# EAGLE design charger_booster_reva (EAGLE 7.2.0)
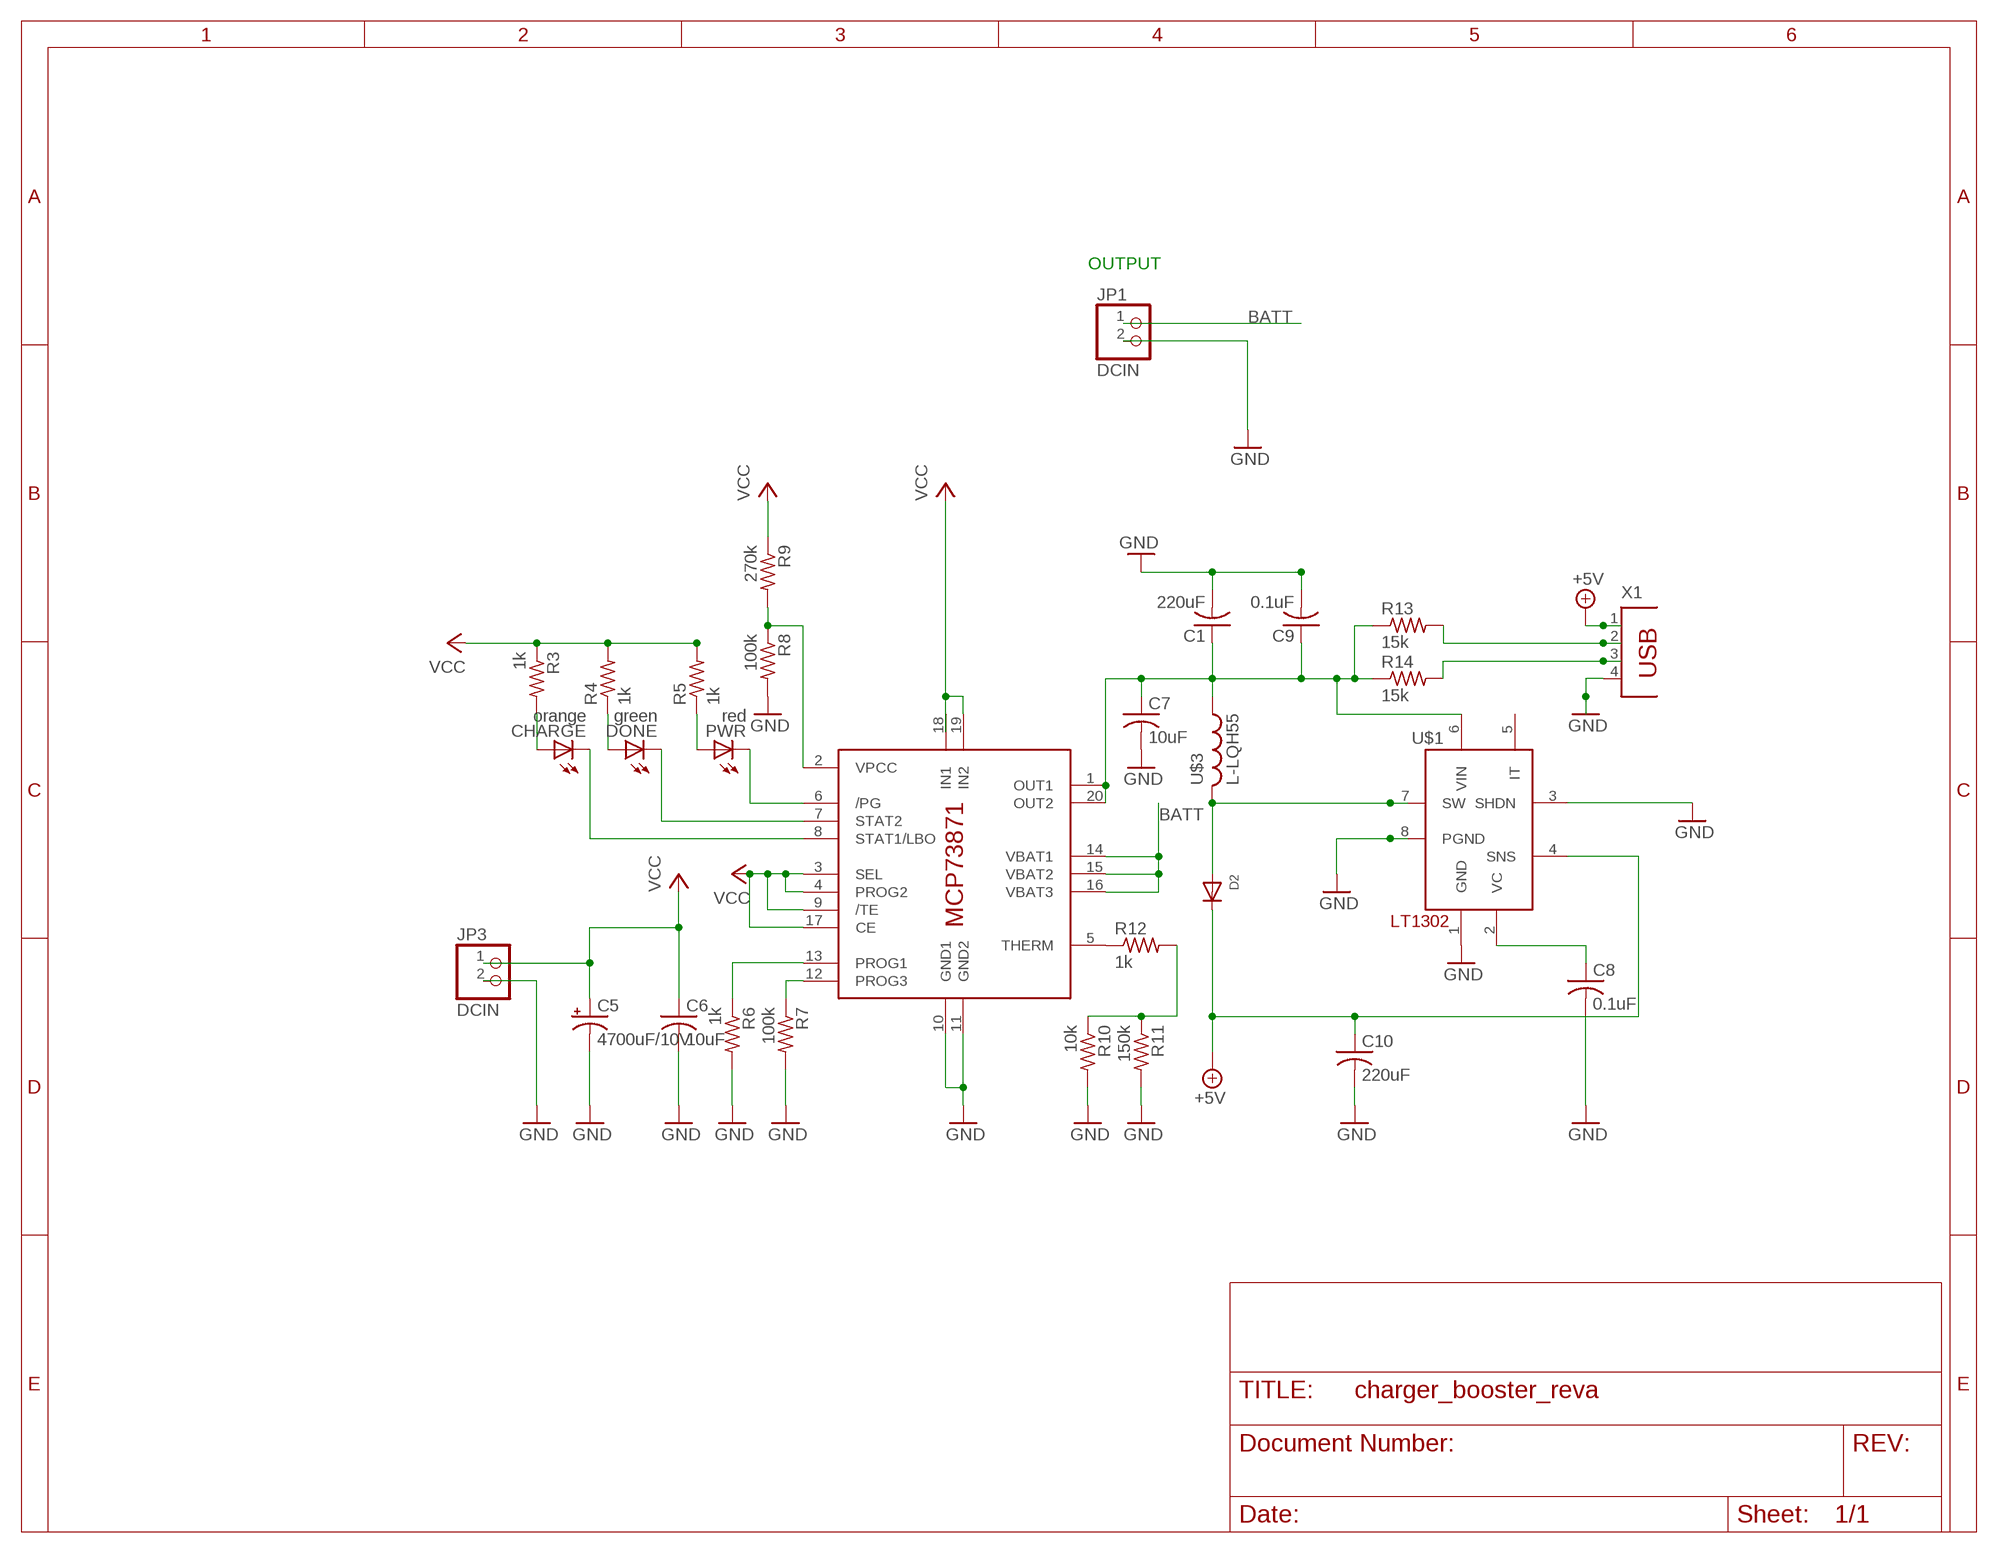
[diagram p0: schematic, sheet 1]

## Parts
C1  220uF  C-USC0805K  [C0805K]
C5  4700uF/10V  CPOL-USE5-13  [E5-13]
C6  10uF  C-USC0805K  [C0805K]
C7  10uF  C-USC0805K  [C0805K]
C8  0.1uF  C-USC0805K  [C0805K]
C9  0.1uF  C-US050-024X044  [C050-024X044]
C10  220uF  C-USC0805K  [C0805K]
CHARGE  orange  LEDCHIPLED_0805  [CHIPLED_0805]
D2  DIODESOD-523  [SOD-523]
DONE  green  LEDCHIPLED_0805  [CHIPLED_0805]
IC1  MCP73871  [QFN20]
JP1  DCIN  PINHD-1X2  [1X02]
JP3  DCIN  PINHD-1X2  [1X02]
PWR  red  LEDCHIPLED_0805  [CHIPLED_0805]
R3  1k  R-US_R0805  [R0805]
R4  1k  R-US_R0805  [R0805]
R5  1k  R-US_R0805  [R0805]
R6  1k  R-US_R0805  [R0805]
R7  100k  R-US_R0805  [R0805]
R8  100k  R-US_R0805  [R0805]
R9  270k  R-US_R0805  [R0805]
R10  10k  R-US_R0805  [R0805]
R11  150k  R-US_R0805  [R0805]
R12  1k  R-US_R0805  [R0805]
R13  15k  R-US_R0805  [R0805]
R14  15k  R-US_R0805  [R0805]
U$1  LT1302  [DIL08]
U$3  L-LQH55  [LQH55]
X1  PN87520  [PN87520]

## Nets
+5V: C10.1 D2.K(C) U$1.4(SNS) X1.1
BATT: IC1.14(VBAT1) IC1.15(VBAT2) IC1.16(VBAT3) JP1.1
GND: C1.2 C5.- C6.2 C7.2 C8.2 C9.2 C10.2 IC1.10(GND1) IC1.11(GND2) JP1.2 JP3.2 R6.2 R7.2 R8.2 R10.2 R11.2 U$1.1(GND) U$1.3(SHDN) U$1.8(PGND) X1.4
N$1: IC1.6(/PG) PWR.C
N$2: R14.2 X1.3
N$3: R13.2 X1.2
N$4: C8.1 U$1.2(VC)
N$5: D2.A U$1.7(SW) U$3.2
N$6: CHARGE.A R3.2
N$7: IC1.13(PROG1) R6.1
N$8: CHARGE.C IC1.8(STAT1/LBO)
N$9: DONE.C IC1.7(STAT2)
N$10: IC1.12(PROG3) R7.1
N$11: DONE.A R4.1
N$12: PWR.A R5.1
N$13: IC1.5(THERM) R12.1
N$16: IC1.2(VPCC) R8.1 R9.2
N$17: R10.1 R11.1 R12.2
OUT: C1.1 C7.1 C9.1 IC1.1(OUT1) IC1.20(OUT2) R13.1 R14.1 U$1.6(VIN) U$3.1
VCC: C5.+ C6.1 IC1.3(SEL) IC1.4(PROG2) IC1.9(/TE) IC1.17(CE) IC1.19(IN2) JP3.1 R3.1 R4.2 R5.2 R9.1
Unconnected: IC1.18(IN1) U$1.5(IT)

## Notes on the sheet
- OUTPUT

## Library data of the parts
C1 C6-C8 C10 = adafruit:C-US: CAPACITOR, American symbol; MPN: 12063D106KAT2A; OC_NEWARK: 60R6374
C5 = adafruit:CPOL-US: POLARIZED CAPACITOR, American symbol; OC_NEWARK: unknown
C9 = adafruit:C-US: CAPACITOR, American symbol; MPN: 0402ZD104KAT2A; OC_NEWARK: 96M1117
CHARGE = adafruit:LED: LED OSRAM: - CHIPLED LG R971, LG N971, LY N971, LG Q971, LY Q971, LO R971, LY R971 LH N974, LH R974 LS Q976, LO Q976, LY Q976 LO Q996 - Hyper CHIPLED LW Q18S LB Q993, LB Q99A, LB R99A - SideLED LS A670, LO A670, LY A670, LG A670, LP A670 LB A673, LV A673, LT A673, LW A673 LH A674 LY A675 LS A676, LA A676, LO A676, LY A676, LW A676 LS A679, LY A679, LG A679 - Hyper Micro SIDELED® LS Y876, LA Y876, LO Y876, LY Y876 LT Y87S - SmartLED LW L88C, LW L88S LB L89C, LB L89S, LG L890 LS L89K, LO L89K, LY L89K LS L896, LA L896, LO L896, LY L896 - TOPLED LS T670, LO T670, LY T670, LG T670, LP T670 LSG T670, LSP T670, LSY T670, LOP T670, LYG T670 LG T671, LOG T671, LSG T671 LB T673, LV T673, LT T673, LW T673 LH T674 LS T676, LA T676, LO T676, LY T676, LB T676, LH T676, LSB T676, LW T676 LB T67C, LV T67C, LT T67C, LS T67K, LO T67K, LY T67K, LW E67C LS E67B, LA E67B, LO E67B, LY E67B, LB E67C, LV E67C, LT E67C LW T67C LS T679, LY T679, LG T679 LS T770, LO T770, LY T770, LG T770, LP T770 LB T773, LV T773, LT T773, LW T773 LH T774 LS E675, LA E675, LY E675, LS T675 LS T776, LA T776, LO T776, LY T776, LB T776 LHGB T686 LT T68C, LB T68C - Hyper Mini TOPLED® LB M676 - Mini TOPLED Santana® LG M470 LS M47K, LO M47K, LY M47K Source: http://www.osram.convergy.de/; OC_NEWARK: unknown
D2 = adafruit:DIODE: Diode SMADIODE - SMA Surface Mount Package 20V 1A Schottky Diode Digikey: 641-1014-6-ND DO-1N4148 - Through Hole Small Current Diode SOD-123 20V 1 A (.5mV Vf) Schottky Diode - Digikey: MBRX120TPMSCT-ND SOD-323 10V 570mA (.38mV Vf, 3ns) Schottky Diode - Digikey: ZLLS410CT-ND SOD-523 30V 30mA Schottky Diode (RB751S-40TE61) - Digikey: RB751S-40TE61CT-ND SOT23-R/W - SOT23 Package (R = Solder Paste/Reflow Ovens, W = Hand-Soldering) BAT54Film 40V 300mA - Digikey: 497-7162-1-ND
DONE = adafruit:LED: LED OSRAM: - CHIPLED LG R971, LG N971, LY N971, LG Q971, LY Q971, LO R971, LY R971 LH N974, LH R974 LS Q976, LO Q976, LY Q976 LO Q996 - Hyper CHIPLED LW Q18S LB Q993, LB Q99A, LB R99A - SideLED LS A670, LO A670, LY A670, LG A670, LP A670 LB A673, LV A673, LT A673, LW A673 LH A674 LY A675 LS A676, LA A676, LO A676, LY A676, LW A676 LS A679, LY A679, LG A679 - Hyper Micro SIDELED® LS Y876, LA Y876, LO Y876, LY Y876 LT Y87S - SmartLED LW L88C, LW L88S LB L89C, LB L89S, LG L890 LS L89K, LO L89K, LY L89K LS L896, LA L896, LO L896, LY L896 - TOPLED LS T670, LO T670, LY T670, LG T670, LP T670 LSG T670, LSP T670, LSY T670, LOP T670, LYG T670 LG T671, LOG T671, LSG T671 LB T673, LV T673, LT T673, LW T673 LH T674 LS T676, LA T676, LO T676, LY T676, LB T676, LH T676, LSB T676, LW T676 LB T67C, LV T67C, LT T67C, LS T67K, LO T67K, LY T67K, LW E67C LS E67B, LA E67B, LO E67B, LY E67B, LB E67C, LV E67C, LT E67C LW T67C LS T679, LY T679, LG T679 LS T770, LO T770, LY T770, LG T770, LP T770 LB T773, LV T773, LT T773, LW T773 LH T774 LS E675, LA E675, LY E675, LS T675 LS T776, LA T776, LO T776, LY T776, LB T776 LHGB T686 LT T68C, LB T68C - Hyper Mini TOPLED® LB M676 - Mini TOPLED Santana® LG M470 LS M47K, LO M47K, LY M47K Source: http://www.osram.convergy.de/; MPN: 150080GS75000; OC_NEWARK: 95W3800
IC1 = adafruit:MCP73871; MPN: MCP73871-2CAI/ML; OC_NEWARK: 54M4956
JP1 JP3 = pinhead:PINHD-1X2: PIN HEADER
PWR = adafruit:LED: LED OSRAM: - CHIPLED LG R971, LG N971, LY N971, LG Q971, LY Q971, LO R971, LY R971 LH N974, LH R974 LS Q976, LO Q976, LY Q976 LO Q996 - Hyper CHIPLED LW Q18S LB Q993, LB Q99A, LB R99A - SideLED LS A670, LO A670, LY A670, LG A670, LP A670 LB A673, LV A673, LT A673, LW A673 LH A674 LY A675 LS A676, LA A676, LO A676, LY A676, LW A676 LS A679, LY A679, LG A679 - Hyper Micro SIDELED® LS Y876, LA Y876, LO Y876, LY Y876 LT Y87S - SmartLED LW L88C, LW L88S LB L89C, LB L89S, LG L890 LS L89K, LO L89K, LY L89K LS L896, LA L896, LO L896, LY L896 - TOPLED LS T670, LO T670, LY T670, LG T670, LP T670 LSG T670, LSP T670, LSY T670, LOP T670, LYG T670 LG T671, LOG T671, LSG T671 LB T673, LV T673, LT T673, LW T673 LH T674 LS T676, LA T676, LO T676, LY T676, LB T676, LH T676, LSB T676, LW T676 LB T67C, LV T67C, LT T67C, LS T67K, LO T67K, LY T67K, LW E67C LS E67B, LA E67B, LO E67B, LY E67B, LB E67C, LV E67C, LT E67C LW T67C LS T679, LY T679, LG T679 LS T770, LO T770, LY T770, LG T770, LP T770 LB T773, LV T773, LT T773, LW T773 LH T774 LS E675, LA E675, LY E675, LS T675 LS T776, LA T776, LO T776, LY T776, LB T776 LHGB T686 LT T68C, LB T68C - Hyper Mini TOPLED® LB M676 - Mini TOPLED Santana® LG M470 LS M47K, LO M47K, LY M47K Source: http://www.osram.convergy.de/; MPN: 150080RS75000; OC_NEWARK: 95W3801
R3-R6 R12 = adafruit:R-US_: RESISTOR, American symbol; MF: FARNELL; MPN: MCF 0.25W 1K; OC_NEWARK: 38K0327
R7 R8 = adafruit:R-US_: RESISTOR, American symbol; MF: FARNELL; MPN: MCF 0.25W 100K; OC_NEWARK: 38K0329
R9 = adafruit:R-US_: RESISTOR, American symbol; MF: AVX CORPORATION; MPN: 08055A270KAT2A; OC_NEWARK: 05H9830
R10 = adafruit:R-US_: RESISTOR, American symbol; MPN: MCHP05W4F1002T5E; OC_NEWARK: 01N6989
R11 = adafruit:R-US_: RESISTOR, American symbol; MPN: MCHP05W4F1503T5E; OC_NEWARK: 01N7003
R13 R14 = adafruit:R-US_: RESISTOR, American symbol
U$1 = adafruit:LT1302; MPN: LT1302CN8-5#PBF; OC_NEWARK: 57M3168
U$3 = adafruit:L
X1 = con-berg:PN87520: BERG USB connector; OC_FARNELL: unknown; OC_NEWARK: unknown

## Board
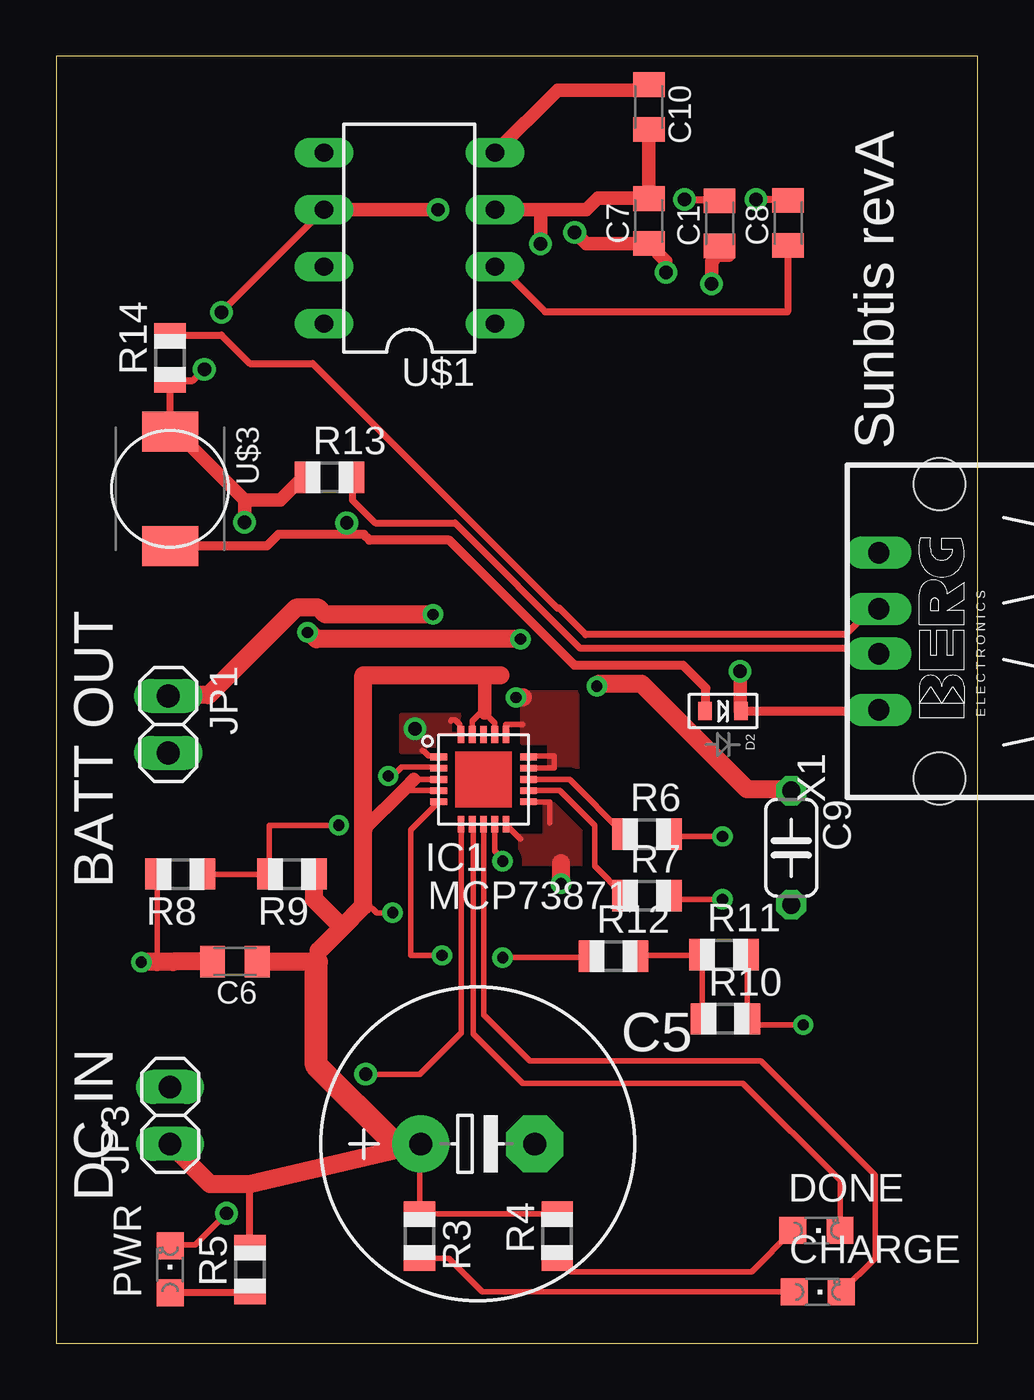
[diagram p1: board, top side]
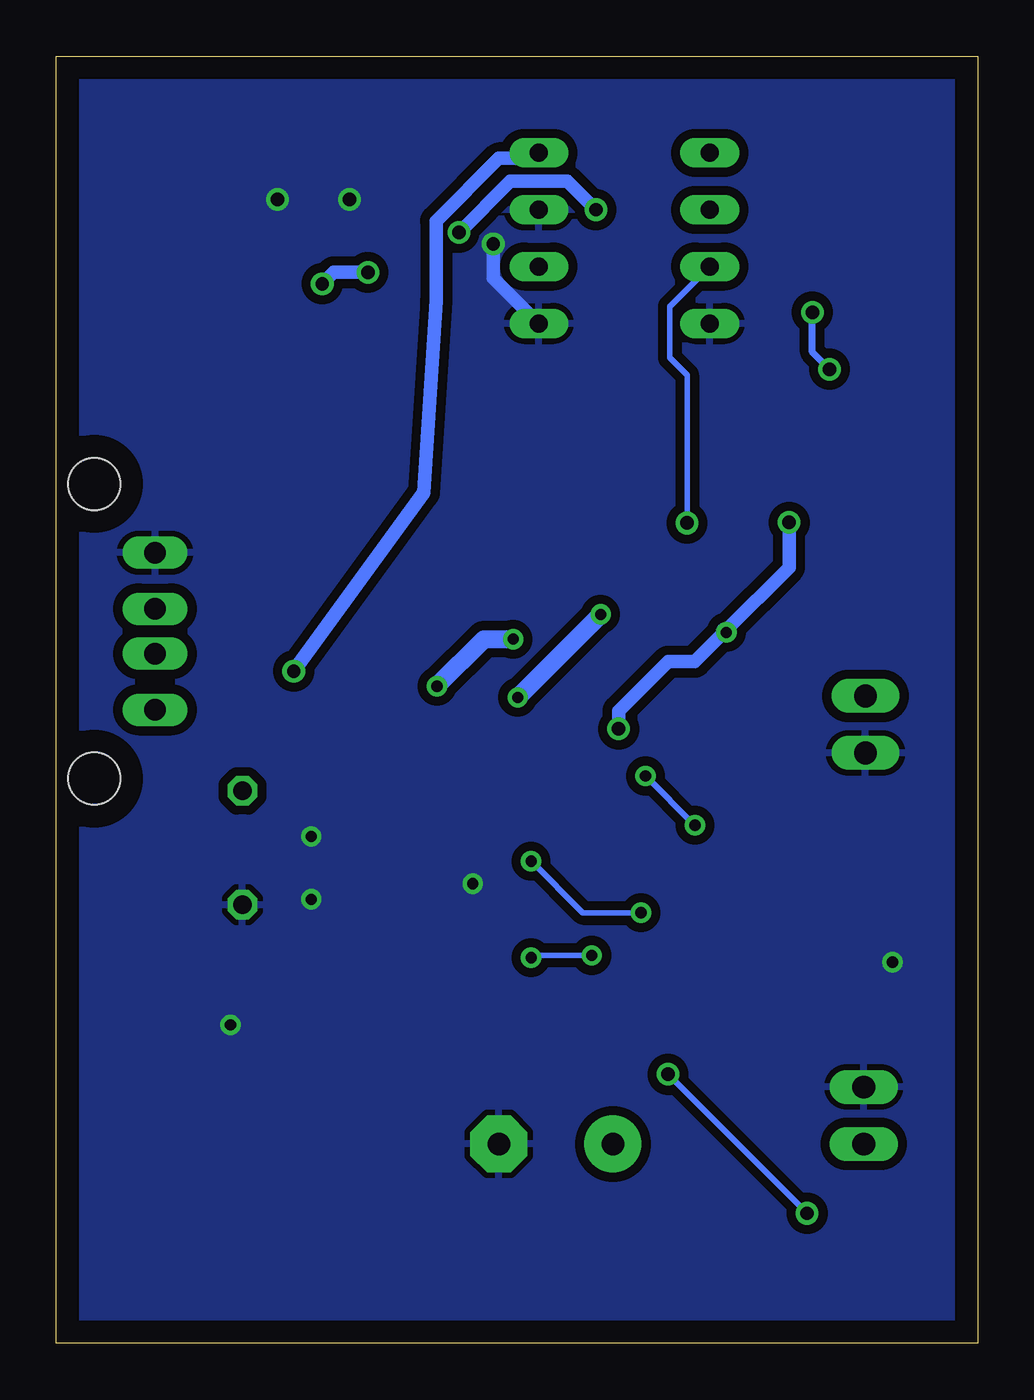
[diagram p2: board, bottom side, seen from below]

Size 41.07 x 57.39 mm. Coordinates in mm from the lower left corner, seen from the top.
Outline: 0,0 41.07,0 41.07,57.39 0,57.39 0,0
Copper layers (1*16): Top 0.035mm / dielectric 1.5mm / Bottom 0.035mm
Design rules "default": minimum track width 10mil, minimum drill 24mil, track to track 8mil, track to pad 8mil, pad to pad 8mil, via to via 8mil, smd to smd 8mil, copper to edge 40mil, drill to drill 8mil, minimum pad ring 10mil, minimum via ring 8mil, stop-mask expansion 4mil, vias tented up to drill 0mil, thermal gap 10mil

### Footprints (pad centres in the part's own frame; a part is rotated, then mirrored left to right if it is on the bottom)
C0805K = smd 1.1 x 1.4: 1 -1,0; 2 1,0
E5-13 = drill 1.016 pad 2.54: + -2.54,0 | drill 1.016 pad 2.54 octagon: - 2.54,0
C050-024X044 = drill 0.813 octagon: 1 -2.54,0; 2 2.54,0
CHIPLED_0805 = smd 1.2 x 1.2: A 0,-1.05; C 0,1.05
SOD-523 = smd 0.8 x 0.6: A 0,-0.8; K 0,0.8
QFN20 = smd 0.75 x 0.3: 1 -2,1; 2 -2,0.5; 3 -2,0; 4 -2,-0.5; 5 -2,-1; 11 2,-1; 12 2,-0.5; 13 2,0; 14 2,0.5; 15 2,1 | smd 0.3 x 0.75: 6 -1,-2; 7 -0.5,-2; 8 0,-2; 9 0.5,-2; 10 1,-2; 16 1,2; 17 0.5,2; 18 0,2; 19 -0.5,2; 20 -1,2
1X02 = drill 1.016 long: 1 -1.27,0; 2 1.27,0
R0805 = smd 1.1 x 1.4: 1 -1,0; 2 1,0
DIL08 = drill 0.813 long: 1 -3.81,-3.81; 2 -1.27,-3.81; 3 1.27,-3.81; 4 3.81,-3.81; 5 3.81,3.81; 6 1.27,3.81; 7 -1.27,3.81; 8 -3.81,3.81
LQH55 = smd 1.8 x 2.5: 1 -2.55,0; 2 2.55,0
PN87520 = drill 0.95 long: 1 -3.5,2.71; 2 -1,2.71; 3 1,2.71; 4 3.5,2.71 | hole 2.3: -6.57,0; 6.57,0

### Placement (x,y rotation side)
C1  29.57,49.93 90 top
C5  18.8,8.89 0 top
C6  7.97,17.03 180 top
C7  26.42,50.04 90 top
C8  32.63,49.96 90 top
C9  32.77,22.1 270 top
C10  26.42,55.12 270 top
CHARGE  33.94,2.3 270 top
D2  29.72,28.19 270 top
DONE  33.89,5.03 270 top
IC1  19.05,25.15 0 top
JP1  5,27.6 270 top
JP3  5.08,10.16 90 top
PWR  5.08,3.3 0 top
R3  16.2,4.78 270 top
R4  22.33,4.78 90 top
R5  8.64,3.3 90 top
R6  26.33,22.7 0 top
R7  26.33,19.96 0 top
R8  5.53,20.93 180 top
R9  10.51,20.93 180 top
R10  29.83,14.47 0 top
R11  29.77,17.34 0 top
R12  24.84,17.27 0 top
R13  12.19,38.61 0 top
R14  5.08,43.94 90 top
U$1  15.75,49.28 90 top
U$3  5.08,38.1 270 top
X1  39.37,31.75 90 top

### Tracks (layer width: path | path; a pad name or v marks a point on that pad's centre or on a via)
+5V  (via drill 0.6)
  Top 0.406: D2.K 36.58,28.19 X1.1
  Top 0.61: U$1.4 22.35,55.88 26.42,55.88 C10.1 | v30.48,29.97 30.48,28.19 D2.K
  Bottom 0.61: v30.48,29.97 24.68,37.93 24.13,46.48 24.13,50.04 21.34,52.83 19.81,52.83 U$1.4
BATT  (via drill 0.5 pad 0.1)
  Top 0.254: IC1.16 20.05,27.6 20.8,27.6 | IC1.15 21.05,26.2 22.2,26.2 22.2,25.65 IC1.14 | 5,28.9 JP1.1
  Top 0.813: v16.8,32.5 12,32.5 11.7,32.8 10.7,32.8 6.8,28.9 5.1,28.9 JP1.1 | 20.8,28.8 v20.5,28.8
  Bottom 0.813: v20.5,28.8 v16.8,32.5
  pour Top (isolate 0.406): 20.8,29 20.8,26.8 22,26.8 22,25.6 23.2,25.6 23.2,29
GND  (via drill 0.5 pad 0.1, 0.5 pad 0.25, 0.6)
  Top 0.254: 36.58,35.31 X1.4 | 4.5,17 4.5,20.1 R8.2 | R11.2 30.8,17.3 30.8,14.5 R10.2 30.8,14.4 30.8,14.3 30.9,14.2 v33.3,14.2 33.4,14.2 | R7.2 27.3,19.9 27.3,19.8 v29.7,19.8 29.8,19.8 | R6.2 27.3,22.7 27.3,22.6 v29.7,22.6 29.8,22.6 | IC1.10 20.7,22.5 | IC1.11 22,24.15 22,23.2
  Top 0.305: v28,51 29.4,51 C1.2 | v31.2,51 32.6,51 C8.2
  Top 0.61: C10.2 26.42,54.36 26.16,54.1 26.42,53.85 C7.2 26.16,51.05 24.13,51.05 23.62,50.55 21.59,50.55 | 21.59,50.55 U$1.3 | v21.59,49.02 21.59,50.55
  Top 0.813: C6.2 5.23,17.03 5.2,17 4.5,17 v3.8,17 | 22.5,21.4 v22.5,20.5
  Bottom 0.61: v21.59,49.02 21.59,47.5 U$1.1
  pour Bottom (isolate 0.406): 0,57.4 41.15,57.4 41.15,57.15 41.15,0 0.25,0 0,0
  pour Top (isolate 0.406): 21.8,24.1 22.1,24.1 23.4,22.8 23.4,21.4 20.7,21.4 20.7,22.6 21.8,22.6 21.8,24
N$1  (via drill 0.6)
  Top 0.254: IC1.6 18.05,13.85 16.2,12 v13.8,12 | v7.6,5.8 6.2,4.4 5.2,4.4 PWR.C
  Bottom 0.254: v13.8,12 v7.6,5.8
N$2
  Top 0.305: 36.58,32.77 X1.3 36.6,32.6 36.2,32.6 35.2,31.6 23.6,31.6 22.4,32.8 22.35,32.77 11.43,43.69 8.64,43.69 7.37,44.96 5.08,44.96 R14.2
N$3
  Top 0.305: 36.58,30.99 X1.2 36.6,31 23.4,31 23.37,30.99 17.78,36.58 14.22,36.58 13.21,37.59 13.21,38.61 R13.2
N$4
  Top 0.305: C8.1 32.6,48.8 32.6,46 21.8,46 19.6,48.2 U$1.2
N$5  (via drill 0.6)
  Top 0.254: v12.95,36.58 12.95,36.07
  Top 0.406: U$3.2 9.4,35.56 9.91,36.07 12.95,36.07 13.72,36.07 13.97,35.81 17.53,35.81 23.11,30.23 27.94,30.23 28.96,29.21 28.96,28.19 D2.A
  Bottom 0.254: v12.95,36.58 12.95,43.18 13.72,43.94 13.72,46.23 U$1.7
N$6
  Top 0.254: CHARGE.A 32.8,2.3 19,2.3 17.5,3.8 16.2,3.8 R3.2
N$7
  Top 0.254: R6.1 22.89,25.15 IC1.13
N$8
  Top 0.254: CHARGE.C 36.5,3.81 36.5,7.5 31.4,12.6 21.1,12.6 19.05,14.65 IC1.8
N$9
  Top 0.254: DONE.C 34.94,7.26 30.6,11.6 20.8,11.6 18.6,13.8 18.6,23.1 IC1.7
N$10
  Top 0.254: R7.1 24,21.29 24,23.1 22.45,24.65 IC1.12
N$11
  Top 0.254: R4.1 22.92,3.2 31,3.2 DONE.A
N$12
  Top 0.305: R5.1 8.59,2.25 PWR.A
N$13  (via drill 0.5 pad 0.25)
  Top 0.254: IC1.5 15.8,22.9 15.8,17.3 v17.2,17.3 | v19.9,17.2 23.8,17.2 R12.1
  Bottom 0.254: v19.9,17.2 19.8,17.3 v17.2,17.3
N$16  (via drill 0.5 pad 0.25)
  Top 0.254: R8.1 6.6,20.9 9.4,20.9 9.5,20.8 9.6,20.9 R9.2 9.5,21 9.5,23.1 v12.6,23.1 | IC1.2 17,25.7 15.4,25.7 15,25.3 v14.8,25.3
  Bottom 0.254: v14.8,25.3 v12.6,23.1
N$17
  Top 0.254: R12.2 25.9,17.3 28.7,17.3 R11.1 28.8,17.3 28.8,14.5 R10.1
OUT  (via drill 0.5 pad 0.1, 0.6)
  Top 0.254: 17.05,26.2 IC1.1 17,26.2 16.6,26.2 16.4,26.4 16.32,26.45 | 17.59,27.75 17.6,27.8 17.8,27.8 18,27.6 18,27.2 IC1.20
  Top 0.305: U$3.1 5.08,42.93 | v7.37,45.97 U$1.6 | v6.6,43.43 6.1,42.93 5.08,42.93 | 5.08,42.93 R14.1
  Top 0.61: v27.18,47.75 27.18,48.26 26.42,49.02 C7.1 26.16,49.02 23.62,49.02 v23.11,49.53 | v29.21,47.24 29.21,48.26 29.46,48.51 29.97,48.51 C1.1 | v17.02,50.55 U$1.6 | v8.4,36.6 8.4,37.6 | 8.4,37.6 10,37.6 11,38.6 R13.1 | 8.4,37.6 5.4,40.6 5.2,40.6 U$3.1
  Top 0.813: v20.7,31.4 11.6,31.4 11.3,31.7 v11.2,31.7 | v24.1,29.3 24.2,29.4 26.1,29.4 30.8,24.7 32.7,24.7 C9.1
  Bottom 0.305: v7.37,45.97 7.37,44.2 v6.6,43.43
  Bottom 0.61: v27.18,47.75 28.7,47.75 v29.21,47.24 | v17.02,50.55 18.29,51.82 20.83,51.82 v23.11,49.53 | v8.4,36.6 8.4,34.6 11.25,31.75 12.6,30.4 13.8,30.4 16,28.2 v16,27.4
  Bottom 0.813: v20.7,31.4 22,31.4 v24.1,29.3 | v11.2,31.7 11.25,31.75
  pour Top (isolate 0.406): 18,27.4 18,28 15.4,28 15.4,26.4 16.8,26.4 16.8,27.2 18,27.2
VCC  (via drill 0.5 pad 0.25)
  Top 0.254: 19.56,27.18 IC1.17 19.55,27.65 19.1,28.1 | 5.4,9 JP3.1 | 11.7,17.5 11.6,17 | C5.+ 16.2,8.83 R3.1 R4.2 | IC1.19 18.55,27.75 19.1,28.3 | IC1.4 15.65,24.65 15.55,24.75 | IC1.3 15.95,25.15 | IC1.9 19.55,21.95 19.95,21.55 v19.9,21.5 | v15,19.2 14.3,19.2 14.1,19.4 13.7,19.5
  Top 0.305: R5.2 8.64,7.11
  Top 0.61: 15,9 C5.+ | 19.1,29.8 19.1,28.3 19.1,28.1 | 15.95,25.15 15.55,24.75 13.7,22.9
  Top 0.813: JP3.1 6.86,7.11 8.64,7.11 C5.+ | 11.6,17 8.99,17 C6.1 | 11.7,17.5 12.75,18.55 | 12.75,18.55 13.7,19.5 13.7,22.9 13.7,29.8 19.1,29.8 19.8,29.8 | 12.75,18.55 11.5,19.8 11.5,20.9 R9.1
  Top 1.016: 11.6,17 11.6,12.4 15,9
  Bottom 0.254: v15,19.2 17.6,19.2 v19.9,21.5

### Text on the board
tPlace: Sunbtis revA | BATT OUT | DC IN